# Altium project PCB.PrjPcb
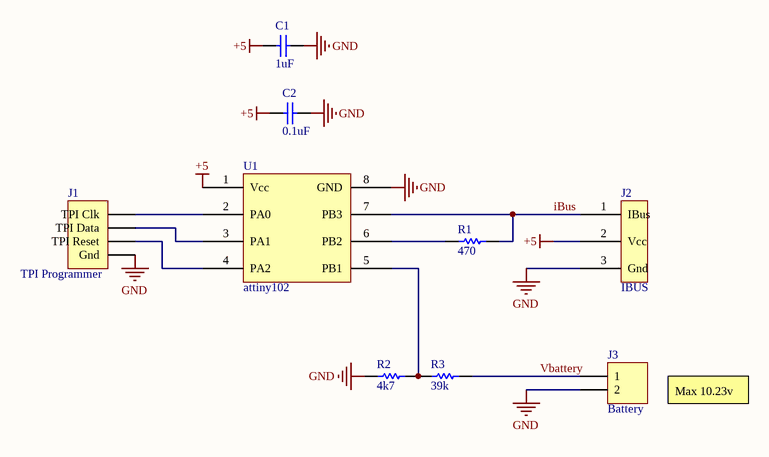
[diagram p0: FlySky Voltage Sensor PCB.SchDoc]
1 sheet, 9 parts. Net scope: global (net labels, ports and power ports of the same name join across sheets).

## Sheet FlySky Voltage Sensor PCB.SchDoc
size A4

### Parts
C1  value 1uF  [Cap SMD 0805A]  (hidden comment: Cap)
C2  value 0.1uF  [Cap SMD 0805A]  (hidden comment: Cap)
J1  TPI Programmer  [HDR1X4]
J2  IBUS  [HDR3]
J3  Battery  [HDR1X2]
R1  value 470  [Res SMD 0805A]  (hidden comment: Res1)
R2  value 4k7  [Res SMD 0805A]  (hidden comment: Res1)
R3  value 39k  [Res SMD 0805A]  (hidden comment: Res1)
U1  attiny102  [SOIC8]

### Nets
+5: C1.2 C2.2 J2.2(Vcc) U1.1(Vcc)
GND: C1.1 C2.1 J1.4(Gnd) J2.3(Gnd) J3.2 R2.2 U1.8(GND)
iBus: J2.1(IBus) R1.1 U1.7(PB3)
Vbattery: J3.1 R3.1
NetJ1_1: J1.1(TPI_Clk) U1.2(PA0)
NetJ1_2: J1.2(TPI_Data) U1.3(PA1)
NetJ1_3: J1.3(TPI_Reset) U1.4(PA2)
NetR1_2: R1.2 U1.6(PB2)
NetR2_1: R2.1 R3.2 U1.5(PB1)

### Notes on the sheet
- Max 10.23v

### Library data of the parts
C1 C2 = Cap: Capacitor; Published: 8-Jun-2000; LatestRevisionDate: 17-Jul-2002; LatestRevisionNote: Re-released for DXP Platform.; PackageReference: RAD-0.3; Publisher: Altium Limited; PackageDescription: Radial Cap, Thru-Hole; 2 Leads; 0.3 in Pin Spacing
J1 = Header 4: Header, 4-Pin; LatestRevisionDate: 17-Jul-2002; LatestRevisionNote: Re-released for DXP Platform.; Publisher: Altium Limited
J2 = SIP3 CONNECTOR
J3 = Header 2: Header, 2-Pin; LatestRevisionDate: 17-Jul-2002; LatestRevisionNote: Re-released for DXP Platform.; Publisher: Altium Limited
R1-R3 = Resistor